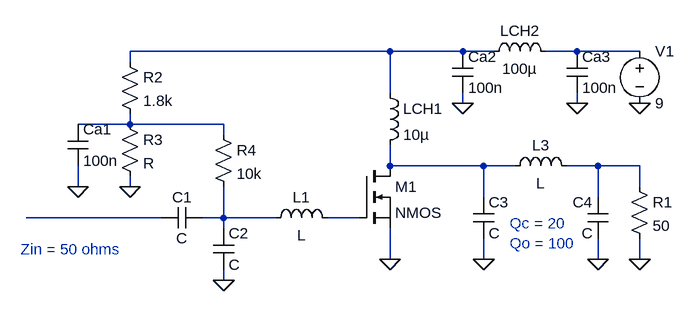
[diagram p0: schematic PA.asc]
PA.asc, the LTspice schematic file:
Version 4
SHEET 1 880 680
WIRE 160 -64 -240 -64
WIRE 272 -64 160 -64
WIRE 320 -64 272 -64
WIRE 448 -64 400 -64
WIRE 544 -64 448 -64
WIRE -240 -48 -240 -64
WIRE 160 0 160 -64
WIRE 272 16 272 0
WIRE 448 16 448 0
WIRE -240 48 -240 32
WIRE -240 48 -320 48
WIRE -96 48 -240 48
WIRE -96 64 -96 48
WIRE 160 112 160 80
WIRE 304 112 160 112
WIRE 352 112 304 112
WIRE 480 112 432 112
WIRE 544 112 480 112
WIRE -320 144 -320 112
WIRE -240 144 -240 128
WIRE 544 144 544 112
WIRE 304 160 304 112
WIRE 480 160 480 112
WIRE -192 192 -400 192
WIRE -96 192 -96 144
WIRE -96 192 -128 192
WIRE -16 192 -96 192
WIRE 112 192 64 192
WIRE -96 208 -96 192
WIRE 160 256 160 208
WIRE 304 256 304 224
WIRE 480 256 480 224
WIRE 544 256 544 224
WIRE -96 288 -96 272
FLAG 160 256 0
FLAG 304 256 0
FLAG 544 256 0
FLAG 448 16 0
FLAG 272 16 0
FLAG 544 16 0
FLAG -240 144 0
FLAG -96 288 0
FLAG -320 144 0
FLAG 480 256 0
SYMBOL nmos 112 112 R0
SYMATTR InstName M1
SYMBOL ind 144 -16 R0
SYMATTR InstName LCH1
SYMATTR Value 10µ
SYMBOL cap 288 160 R0
SYMATTR InstName C3
SYMBOL cap 496 224 R180
WINDOW 0 24 56 Left 2
WINDOW 3 24 8 Left 2
SYMATTR InstName C4
SYMBOL res 528 128 R0
SYMATTR InstName R1
SYMATTR Value 50
SYMBOL voltage 544 -80 R0
SYMATTR InstName V1
SYMATTR Value 9
SYMBOL cap 432 -64 R0
SYMATTR InstName Ca3
SYMATTR Value 100n
SYMBOL ind 304 -48 R270
WINDOW 0 32 56 VTop 2
WINDOW 3 5 56 VBottom 2
SYMATTR InstName LCH2
SYMATTR Value 100µ
SYMBOL cap 256 -64 R0
SYMATTR InstName Ca2
SYMATTR Value 100n
SYMBOL res -256 -64 R0
SYMATTR InstName R2
SYMATTR Value 1.8k
SYMBOL res -256 32 R0
SYMATTR InstName R3
SYMBOL cap -112 208 R0
SYMATTR InstName C2
SYMBOL cap -128 176 R90
WINDOW 0 0 32 VBottom 2
WINDOW 3 32 32 VTop 2
SYMATTR InstName C1
SYMBOL ind -32 208 R270
WINDOW 0 32 56 VTop 2
WINDOW 3 5 56 VBottom 2
SYMATTR InstName L1
SYMBOL cap -336 48 R0
SYMATTR InstName Ca1
SYMATTR Value 100n
SYMBOL ind 336 128 R270
WINDOW 0 32 56 VTop 2
WINDOW 3 5 56 VBottom 2
SYMATTR InstName L3
SYMBOL res -112 48 R0
SYMATTR InstName R4
SYMATTR Value 10k
TEXT -408 240 Left 2 ;Zin = 50 ohms
TEXT 344 200 Left 2 ;Qc = 20\nQo = 100

The netlist it stands for:
* PA.asc
M1 N004 N008 0 0 NMOS
LCH1 N001 N004 10µ
C3 N004 0 C
C4 0 N005 C
R1 N005 0 50
V1 N002 0 9
Ca3 N002 0 100n
LCH2 N001 N002 100µ
Ca2 N001 0 100n
R2 N001 N003 1.8k
R3 N003 0 R
C2 N007 0 C
C1 N007 N006 C
L1 N007 N008 L
Ca1 N003 0 100n
L3 N004 N005 L
R4 N003 N007 10k
.model NMOS NMOS
.model PMOS PMOS
.lib standard.mos
* Zin = 50 ohms
* Qc = 20
* Qo = 100
.backanno
.end